# EAGLE design cnd_distributor (EAGLE 6.4)
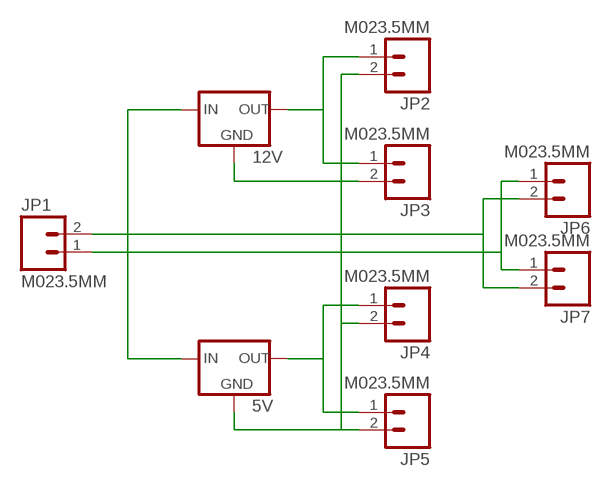
[diagram p0: schematic, sheet 1]

## Parts
5V  78XXS  [78XXS]
12V  78XXS  [78XXS]
JP1  M023.5MM  [SCREWTERMINAL-3.5MM-2]
JP2  M023.5MM  [SCREWTERMINAL-3.5MM-2]
JP3  M023.5MM  [SCREWTERMINAL-3.5MM-2]
JP4  M023.5MM  [SCREWTERMINAL-3.5MM-2]
JP5  M023.5MM  [SCREWTERMINAL-3.5MM-2]
JP6  M023.5MM  [SCREWTERMINAL-3.5MM-2]
JP7  M023.5MM  [SCREWTERMINAL-3.5MM-2]

## Nets
5V: 12V.OUT JP2.1 JP3.1
12V: 5V.OUT JP4.1 JP5.1
24V: 5V.IN 12V.IN JP1.1 JP6.1 JP7.1
GND: 5V.GND 12V.GND JP1.2 JP2.2 JP3.2 JP4.2 JP5.2 JP6.2 JP7.2

## Library data of the parts
5V 12V = v-reg:78XXS: VOLTAGE REGULATOR
JP1-JP7 = SparkFun-Connectors:M02: Standard 2-pin 0.1" header. Use with - straight break away headers ( PRT-00116) - right angle break away headers (PRT-00553) - swiss pins (PRT-00743) - machine pins (PRT-00117) - female headers (PRT-00115) Molex polarized connector foot print use with: PRT-08233 with associated crimp pins and housings. 2.54_SCREWTERM for use with PRT-10571. 3.5mm Screw Terminal footprints for PRT-08084 5mm Screw Terminal footprints for use with PRT-08433

## Board
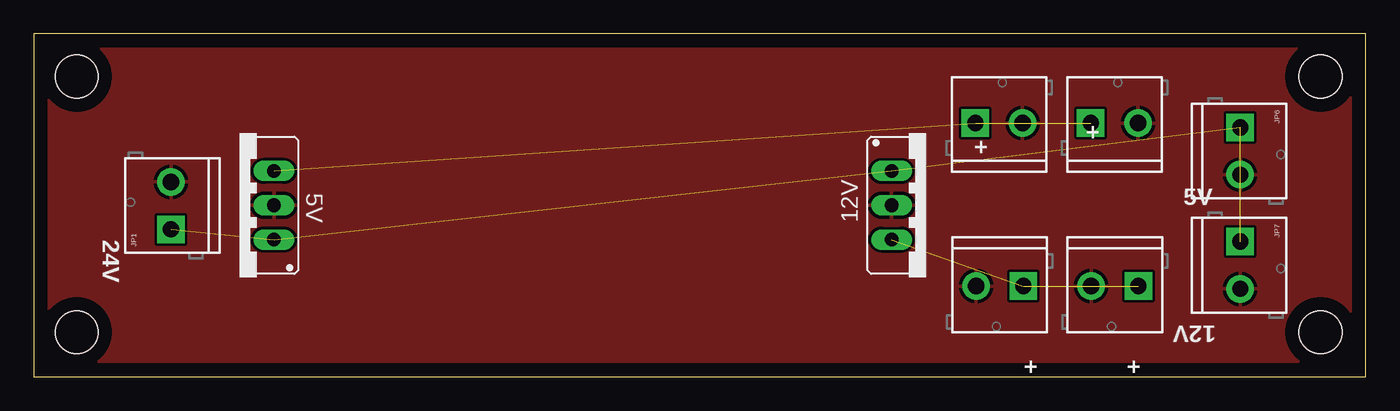
[diagram p1: board, top side]

Size 98.6 x 25.39 mm. Coordinates in mm from the lower left corner, seen from the top.
Outline: 0,0 98.6,0 98.6,25.39 0,25.39 0,0
Copper layers (1*16): Top 0.035mm / dielectric 1.5mm / Bottom 0.035mm
Design rules "default": minimum track width 10mil, minimum drill 24mil, track to track 8mil, track to pad 8mil, pad to pad 8mil, via to via 8mil, smd to smd 8mil, copper to edge 40mil, drill to drill 8mil, minimum pad ring 10mil, minimum via ring 8mil, stop-mask expansion 4mil, vias tented up to drill 0mil, thermal gap 10mil
Holes 3.17 mm at 3.17,22.23 3.17,3.3 95.25,3.3 95.25,22.23

### Footprints (pad centres in the part's own frame; a part is rotated, then mirrored left to right if it is on the bottom)
78XXS = drill 1.016 long: GND 0,-2.54; IN -2.54,-2.54; OUT 2.54,-2.54
SCREWTERMINAL-3.5MM-2 = drill 1.2 pad 2.032 square: 1 0,0 | drill 1.2 pad 2.032: 2 3.5,0

### Placement (x,y rotation side)
5V  15.24,12.7 90 top
12V  66.04,12.7 270 top
JP1  10.16,10.92 90 top
JP2  73.26,6.72 180 top
JP3  81.78,6.72 180 top
JP4  78.25,18.78 0 top
JP5  69.7,18.78 0 top
JP6  89.31,18.46 270 top
JP7  89.31,10.01 270 top

### Tracks (layer width: path | path; a pad name or v marks a point on that pad's centre or on a via)
5V  (2 unrouted)
12V  (2 unrouted)
24V  (4 unrouted)
GND
  pour Top: -1.27,26.67 -1.27,-1.27 100.46,-1.4 100.46,26.54

### Text on the board
tNames: + | + | 5V | 24V | 12V | + | +